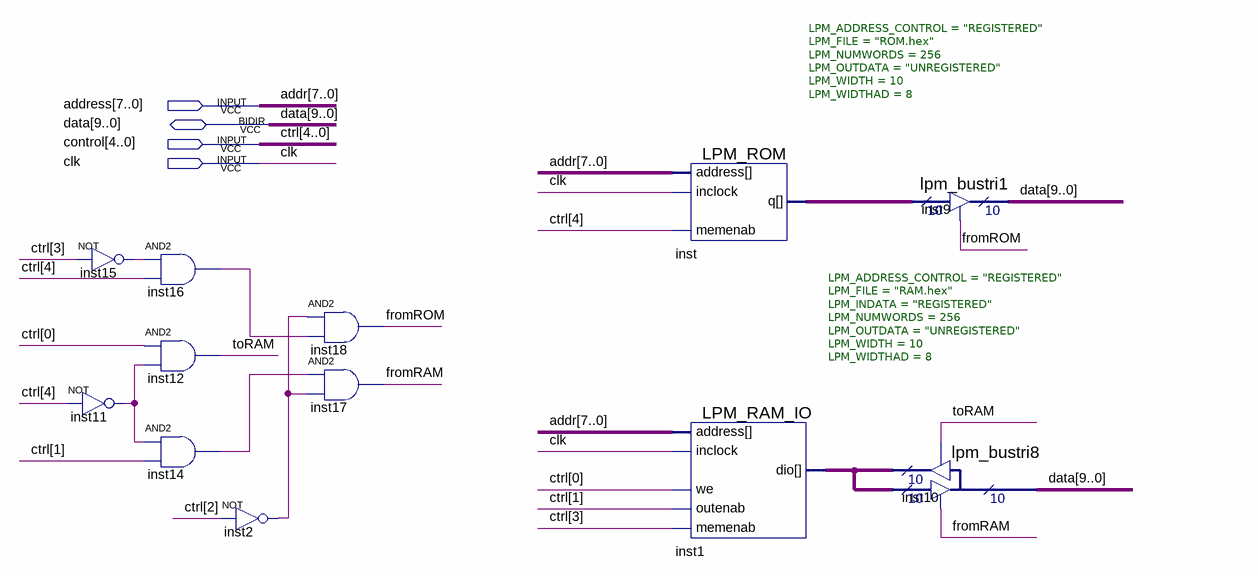
[diagram p0: schematic sheet]
// Quartus schematic Memory.bdf as structural Verilog: 12 symbols, 4 pins
module Memory (
  input  [7:0] address,
  input  [4:0] control,
  input  clk,
  inout  [9:0] data
);

  wire fromRAM, fromROM, inst2_out, inst11_out, inst14_out, inst15_out, inst16_out, toRAM;
  wire [9:0] inst1_dio, inst_q;

  not inst15 (inst15_out, control[3]);
  not inst11 (inst11_out, control[4]);
  and inst16 (inst16_out, inst15_out, control[4]);
  and inst12 (toRAM, control[0], inst11_out);
  and inst14 (inst14_out, inst11_out, control[1]);
  not inst2 (inst2_out, control[2]);
  and inst18 (fromROM, inst2_out, inst16_out);
  and inst17 (fromRAM, inst14_out, inst2_out);
  LPM_ROM #(.LPM_ADDRESS_CONTROL("REGISTERED"), .LPM_FILE("ROM.hex"), .LPM_NUMWORDS(256), .LPM_OUTDATA("UNREGISTERED"), .LPM_WIDTH(10), .LPM_WIDTHAD(8)) inst (
    .address(address), .inclock(clk), .memenab(control[4]), .q(inst_q));
  LPM_RAM_IO #(.LPM_ADDRESS_CONTROL("REGISTERED"), .LPM_FILE("RAM.hex"), .LPM_INDATA("REGISTERED"), .LPM_NUMWORDS(256), .LPM_OUTDATA("UNREGISTERED"), .LPM_WIDTH(10), .LPM_WIDTHAD(8)) inst1 (
    .address(address), .memenab(control[3]), .inclock(clk), .we(control[0]), .outenab(control[1]),
    .dio(inst1_dio));
  lpm_bustri8 inst10 (.enabledt(fromRAM), .data(inst1_dio), .enabletr(toRAM), .result(inst1_dio), .tridata(data));
  lpm_bustri1 inst9 (.enabledt(fromROM), .data(inst_q), .tridata(data));

  // Other names for the same wires on the sheet: addr[7:0] = address; ctrl[4:0] = control
endmodule
